# EAGLE design tick-box-1591A-mk-3.1 (EAGLE 6.5.0)
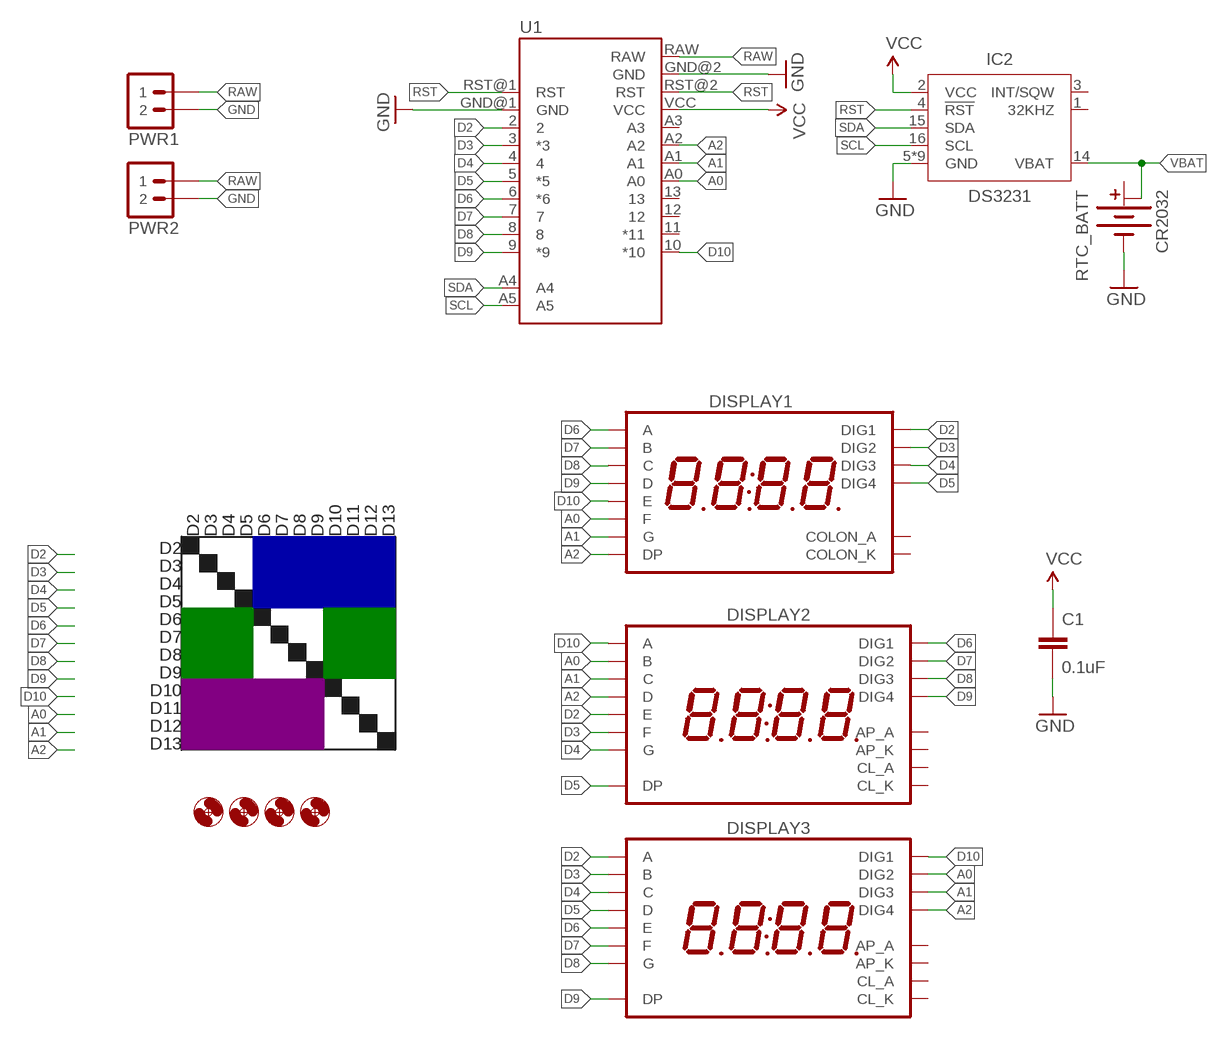
[diagram p0: schematic, sheet 1]

## Parts
C1  0.1uF  CAPACITOR-CERAMIC025-024X044  [C025-024X044]
DISPLAY1  7SEG_4DIGIT_COLON14.2MM-CC-NS  [7SEG_4DIG_NS]
DISPLAY2  7SEG_4DIGIT_COLON_APOS  [7SEG_4DIG_10MM]
DISPLAY3  7SEG_4DIGIT_COLON_APOS  [7SEG_4DIG_10MM]
H1  HOLE#2  [HOLE-#2]
H2  HOLE#2  [HOLE-#2]
H3  HOLE#2  [HOLE-#2]
H4  HOLE#2  [HOLE-#2]
IC2  DS3231  [SO16W]
PWR1  M02PTH-CENTERED  [1X02-CENTER]
PWR2  M02PTH-CENTERED  [1X02-CENTER]
RTC_BATT  CR2032  BATTERY-COINCR2032_SMD  [BATTCON_20MM_MINE]
U1  ARDUINO_PRO_MINI_TICK  [ARDUINO_PRO_MINI_TICK]

## Nets
A0: DISPLAY1.P$12(F) DISPLAY2.16(B) DISPLAY3.2(DIG2) U1.A0
A1: DISPLAY1.P$5(G) DISPLAY2.13(C) DISPLAY3.6(DIG3) U1.A1
A2: DISPLAY1.P$3(DP) DISPLAY2.3(D) DISPLAY3.8(DIG4) U1.A2
D2: DISPLAY1.P$14(DIG1) DISPLAY2.5(E) DISPLAY3.14(A) U1.2
D3: DISPLAY1.P$11(DIG2) DISPLAY2.11(F) DISPLAY3.16(B) U1.3(*3)
D4: DISPLAY1.P$10(DIG3) DISPLAY2.15(G) DISPLAY3.13(C) U1.4
D5: DISPLAY1.P$6(DIG4) DISPLAY2.7(DP) DISPLAY3.3(D) U1.5(*5)
D6: DISPLAY1.P$13(A) DISPLAY2.1(DIG1) DISPLAY3.5(E) U1.6(*6)
D7: DISPLAY1.P$9(B) DISPLAY2.2(DIG2) DISPLAY3.11(F) U1.7
D8: DISPLAY1.P$4(C) DISPLAY2.6(DIG3) DISPLAY3.15(G) U1.8
D9: DISPLAY1.P$2(D) DISPLAY2.8(DIG4) DISPLAY3.7(DP) U1.9(*9)
D10: DISPLAY1.P$1(E) DISPLAY2.14(A) DISPLAY3.1(DIG1) U1.10(*10)
GND: C1.2 IC2.5(GND) IC2.6(GND) IC2.7(GND) IC2.8(GND) IC2.9(GND) IC2.10(GND) IC2.11(GND) IC2.12(GND) IC2.13(GND) PWR1.2 PWR2.2 RTC_BATT.BOTTOM(-) U1.GND@1(GND) U1.GND@2(GND)
RAW: PWR1.1 PWR2.1 U1.RAW
RST: IC2.4(!RST) U1.RST@1(RST) U1.RST@2(RST)
SCL: IC2.16(SCL) U1.A5
SDA: IC2.15(SDA) U1.A4
VBAT: IC2.14(VBAT) RTC_BATT.TOP@2(+1)
VCC: C1.1 IC2.2(VCC) U1.VCC
Unconnected: DISPLAY1.P$7(COLON_K) DISPLAY1.P$8(COLON_A) DISPLAY2.4(CL_A) DISPLAY2.9(AP_K) DISPLAY2.10(AP_A) DISPLAY2.12(CL_K) DISPLAY3.4(CL_A) DISPLAY3.9(AP_K) DISPLAY3.10(AP_A) DISPLAY3.12(CL_K) IC2.1(32KHZ) IC2.3(INT/SQW) RTC_BATT.TOP@1(+) U1.11(*11) U1.12 U1.13 U1.A3

## Notes on the sheet
- D2 | D3 | D4 | D5 | D6 | D7 | D8 | D9 | D10 | D11 | D12 | D13
- D2
- D3
- D4
- D5
- D6
- D7
- D8
- D9
- D10
- D11
- D12
- D13

## Library data of the parts
C1 = A_butts:CAPACITOR-CERAMIC: CAPACITOR, European symbol
DISPLAY1 = A_butts:7SEG_4DIGIT_COLON
DISPLAY2 DISPLAY3 = A_butts:7SEG_4DIGIT_COLON_APOS
H1-H4 = A_butts:HOLE: MOUNTING HOLE with drill center marker
IC2 = A_butts:DS3231
PWR1 PWR2 = A_butts:M02: Standard 2-pin 0.1" header. Use with - straight break away headers ( PRT-00116) - right angle break away headers (PRT-00553) - swiss pins (PRT-00743) - machine pins (PRT-00117) - female headers (PRT-00115) Molex polarized connector foot print use with: PRT-08233 with associated crimp pins and housings. 2.54_SCREWTERM for use with PRT-10571. 3.5mm Screw Terminal footprints for PRT-08084 5mm Screw Terminal footprints for use with PRT-08433
RTC_BATT = A_butts:BATTERY-COIN
U1 = A_butts:ARDUINO_PRO_MINI_TICK

## Board
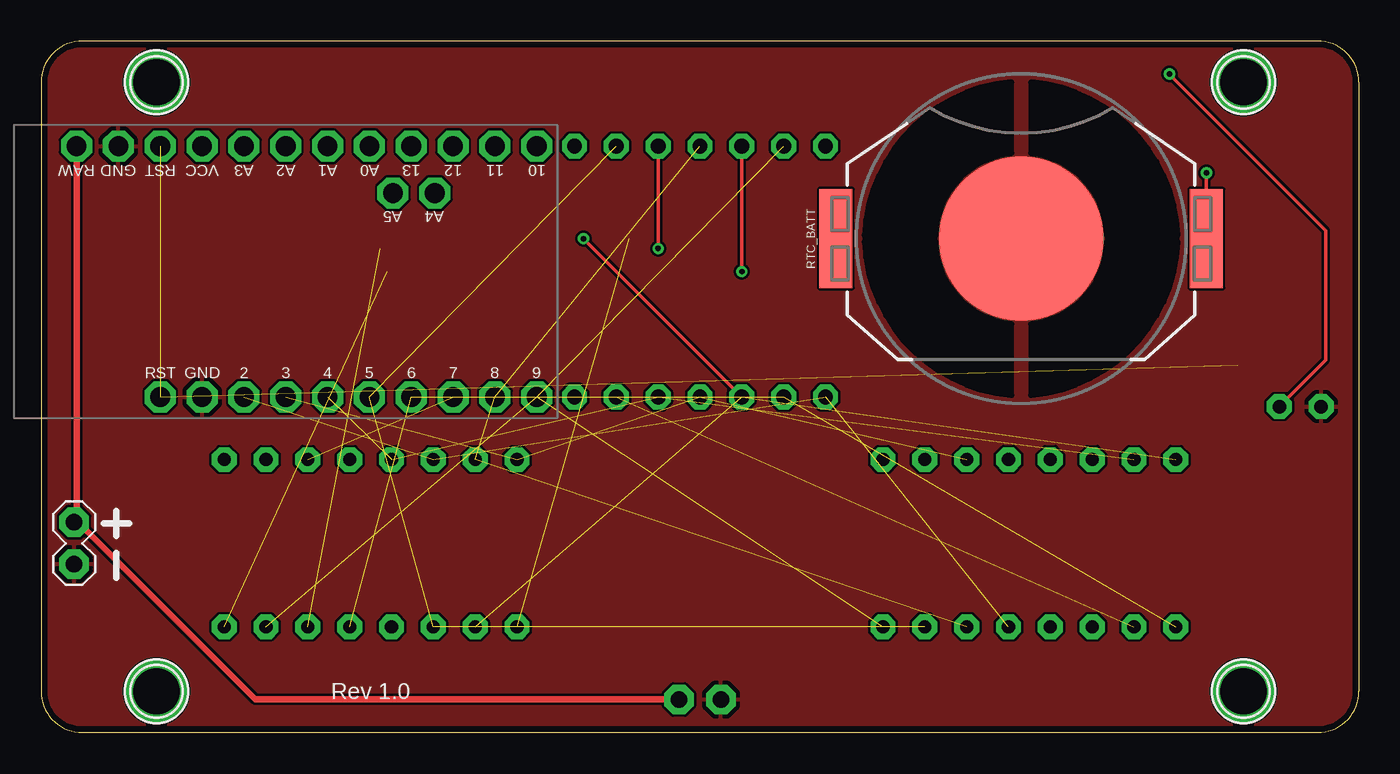
[diagram p1: board, top side]
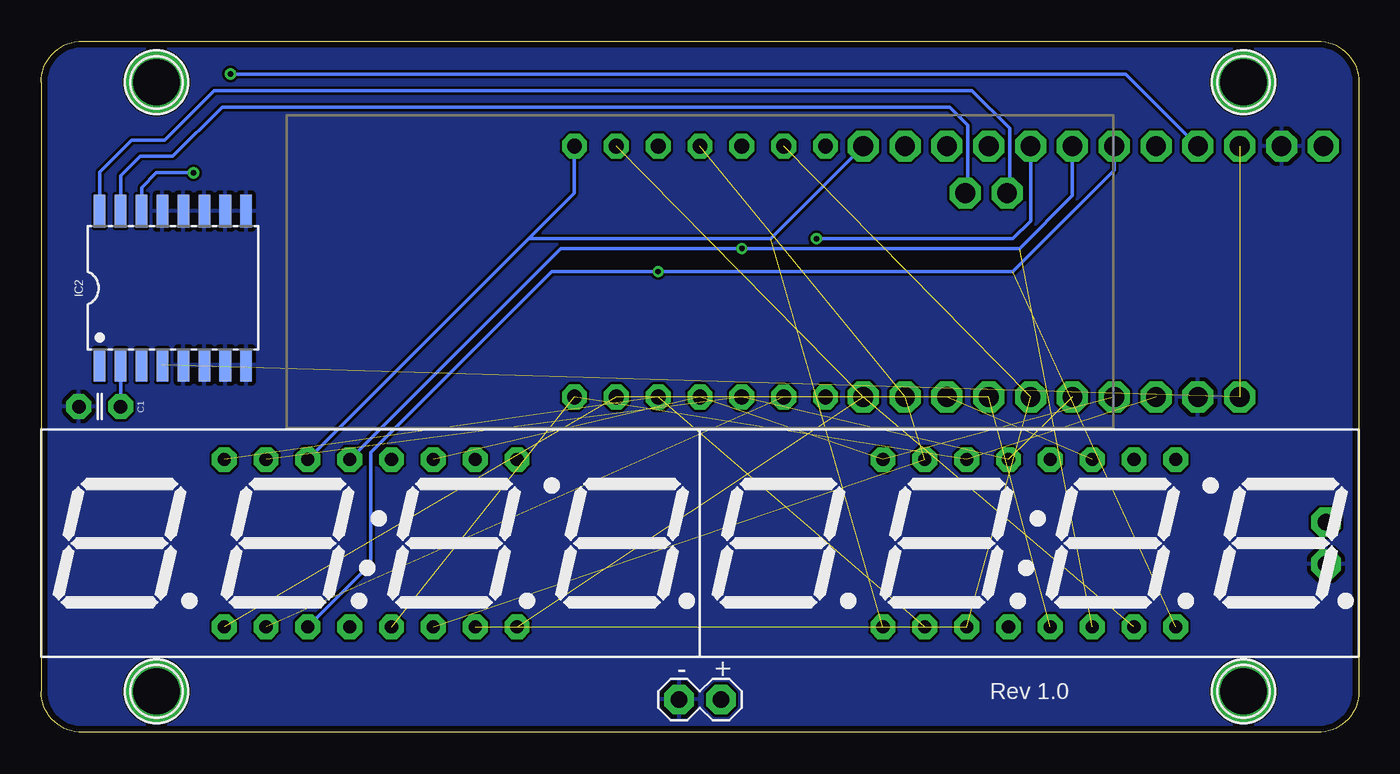
[diagram p2: board, bottom side, seen from below]

Size 80 x 42 mm. Coordinates in mm from the lower left corner, seen from the top.
Outline: 80,39.5 arc90 77.5,42 2.5,42 arc90 0,39.5 0,2.5 arc90 2.5,0 77.5,0 arc90 80,2.5 80,39.5
Copper layers (1*16): Top 0.0356mm / dielectric 1.5011mm / Bottom 0.0356mm
Design rules "LaenPCBOrder_2": minimum track width 6mil, minimum drill 13mil, track to track 6mil, track to pad 6mil, pad to pad 6mil, via to via 6mil, smd to smd 6mil, copper to edge 15mil, drill to drill 6mil, minimum pad ring 7mil, minimum via ring 7mil, stop-mask expansion 3mil, vias tented up to drill 20mil, thermal gap 10mil

### Footprints (pad centres in the part's own frame; a part is rotated, then mirrored left to right if it is on the bottom)
C025-024X044 = drill 0.813 pad 1.5 octagon: 1 -1.27,0; 2 1.27,0
7SEG_4DIG_NS = drill 0.9 pad 1.5 octagon: P$1 -7.62,7.62; P$2 -5.08,7.62; P$3 -2.54,7.62; P$4 0,7.62; P$5 2.54,7.62; P$6 5.08,7.62; P$7 7.62,7.62; P$8 7.62,-7.62; P$9 5.08,-7.62; P$10 2.54,-7.62; P$11 0,-7.62; P$12 -2.54,-7.62; P$13 -5.08,-7.62; P$14 -7.62,-7.62
7SEG_4DIG_10MM = drill 0.8 pad 1.5 octagon: 1 -8.89,-5.08; 2 -6.35,-5.08; 3 -3.81,-5.08; 4 -1.27,-5.08; 5 1.27,-5.08; 6 3.81,-5.08; 7 6.35,-5.08; 8 8.89,-5.08; 9 8.89,5.08; 10 6.35,5.08; 11 3.81,5.08; 12 1.27,5.08; 13 -1.27,5.08; 14 -3.81,5.08; 15 -6.35,5.08; 16 -8.89,5.08
HOLE-#2 = drill 2.8 pad 3.81: P$1 0,0
SO16W = smd 0.7 x 2: 1 -4.445,-4.685; 2 -3.175,-4.685; 3 -1.905,-4.685; 4 -0.635,-4.685; 5 0.635,-4.685; 6 1.905,-4.685; 7 3.175,-4.685; 8 4.445,-4.685; 9 4.445,4.685; 10 3.175,4.685; 11 1.905,4.685; 12 0.635,4.685; 13 -0.635,4.685; 14 -1.905,4.685; 15 -3.175,4.685; 16 -4.445,4.685
1X02-CENTER = drill 1 pad 1.8 octagon: 1 -1.27,0; 2 1.27,0
BATTCON_20MM_MINE = smd 10 x 10: BOTTOM 0,0 | smd 6 x 2: TOP@1 0,11.25; TOP@2 0,-11.25
ARDUINO_PRO_MINI_TICK = drill 1.2 pad 1.88 octagon: 2 -7.62,2.54; 3 -7.62,0; 4 -7.62,-2.54; 5 -7.62,-5.08; 6 -7.62,-7.62; 7 -7.62,-10.16; 8 -7.62,-12.7; 9 -7.62,-15.24; 10 7.62,-15.24; 11 7.62,-12.7; 12 7.62,-10.16; 13 7.62,-7.62; A0 7.62,-5.08; A1 7.62,-2.54; A2 7.62,0; A3 7.62,2.54; A4 4.763,-9.049; A5 4.763,-6.509; GND@1 -7.62,5.08; GND@2 7.62,10.16; RAW 7.62,12.7; RST@1 -7.62,7.62; RST@2 7.62,7.62; VCC 7.62,5.08

### Placement (x,y rotation side)
C1  76.44,19.8 180 bottom
DISPLAY1  40,28 0 bottom
DISPLAY2  60,11.5 0 bottom
DISPLAY3  20,11.5 0 bottom
H1  7,2.5 0 top
H2  7,39.5 0 top
H3  73,2.5 0 top
H4  73,39.5 0 top
IC2  72,27 0 bottom
PWR1  2,11.5 270 top
PWR2  40,2 180 bottom
RTC_BATT  59.5,30 90 top
U1  14.85,28 90 top

### Tracks (layer width: path | path; a pad name or v marks a point on that pad's centre or on a via)
A0  (via drill 0.33)  (2 unrouted)
  Top 0.2: v32.92,30 DISPLAY1.P$12
  Bottom 0.2: U1.A0 19.93,31.07 21,30 v32.92,30
A1  (via drill 0.33)  (1 unrouted)
  Top 0.2: v37.46,29.4 DISPLAY1.P$5
  Bottom 0.2: U1.A1 17.39,32.61 20.6,29.4 v37.46,29.4 48.45,29.4 DISPLAY2.13
A2  (via drill 0.33)  (1 unrouted)
  Top 0.2: v42.54,28 DISPLAY1.P$3
  Bottom 0.2: U1.A2 14.85,34.15 21,28 v42.54,28 49,28 60,17 60,10.23 DISPLAY2.3
D2  (3 unrouted)
D3  (3 unrouted)
D4  (3 unrouted)
D5  (3 unrouted)
D6  (3 unrouted)
D7  (3 unrouted)
D8  (3 unrouted)
D9  (3 unrouted)
D10  (1 unrouted)
  Bottom 0.2: U1.10 35.71,30 50.39,30 | 50.39,30 DISPLAY2.14 | DISPLAY1.P$1 47.62,32.77 50.39,30
GND
  pour Top: 80,2.5 arc-90 77.5,0 2.5,0 arc-90 0,2.5 0,39.5 arc-90 2.5,42 77.5,42 arc-90 80,39.5
  pour Bottom: 80,2.5 arc-90 77.5,0 2.5,0 arc-90 0,2.5 0,39.5 arc-90 2.5,42 77.5,42 arc-90 80,39.5
RAW
  Top 0.4: U1.RAW 2.15,13 | 2.15,13 2.15,12.85 13,2 PWR2.1 | PWR1.1 2,12.85 2.15,13
RST  (2 unrouted)
SCL
  Bottom 0.2: IC2.16 76.44,34.05 74.5,36 72.5,36 69.5,39 23.5,39 21.2,36.7 21.2,32.92 U1.A5
SDA
  Bottom 0.2: IC2.15 75.17,33.83 74,35 72,35 69,38 24.84,38 23.74,36.9 23.74,32.92 U1.A4
VBAT  (via drill 0.33)
  Top 0.2: RTC_BATT.TOP@2 v70.75,34
  Bottom 0.2: IC2.14 73.91,33.09 73,34 v70.75,34
VCC  (via drill 0.33)
  Top 0.2: v68.5,40 78,30.5 78,22.62 C1.1
  Bottom 0.2: IC2.2 C1.1 | U1.VCC 14.15,40 v68.5,40

### Text on the board
bPlace: + | -